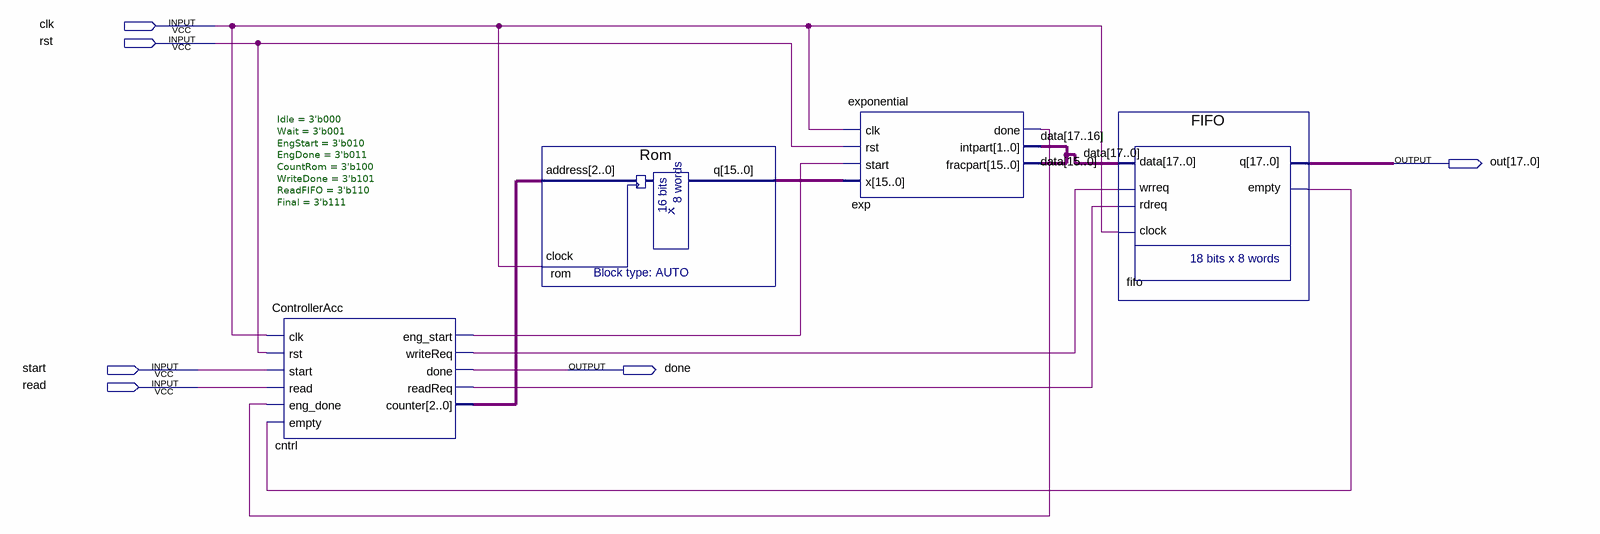
[diagram p0: schematic sheet]
// Quartus schematic Accelerator.bdf as structural Verilog: 4 symbols, 6 pins
module Accelerator (
  input  clk,
  input  rst,
  input  start,
  input  read,
  output [17:0] out,
  output done
);

  wire cntrl_eng_start, cntrl_readreq, cntrl_writereq, exp_done, fifo_empty;
  wire [2:0] cntrl_counter;
  wire [15:0] rom_q;
  wire [17:0] data;

  ControllerAcc #(.Idle(3'b000), .Wait(3'b001), .EngStart(3'b010), .EngDone(3'b011), .CountRom(3'b100), .WriteDone(3'b101), .ReadFIFO(3'b110), .Final(3'b111)) cntrl (
    .clk(clk), .rst(rst), .start(start), .read(read), .eng_done(exp_done), .empty(fifo_empty),
    .eng_start(cntrl_eng_start), .writeReq(cntrl_writereq), .done(done), .readReq(cntrl_readreq),
    .counter(cntrl_counter));
  Rom rom (.address(cntrl_counter), .clock(clk), .q(rom_q));
  exponential exp (
    .clk(clk), .rst(rst), .start(cntrl_eng_start), .x(rom_q), .done(exp_done), .intpart(data[17:16]),
    .fracpart(data[15:0]));
  FIFO fifo (.data(data), .wrreq(cntrl_writereq), .rdreq(cntrl_readreq), .clock(clk), .q(out), .empty(fifo_empty));
endmodule
